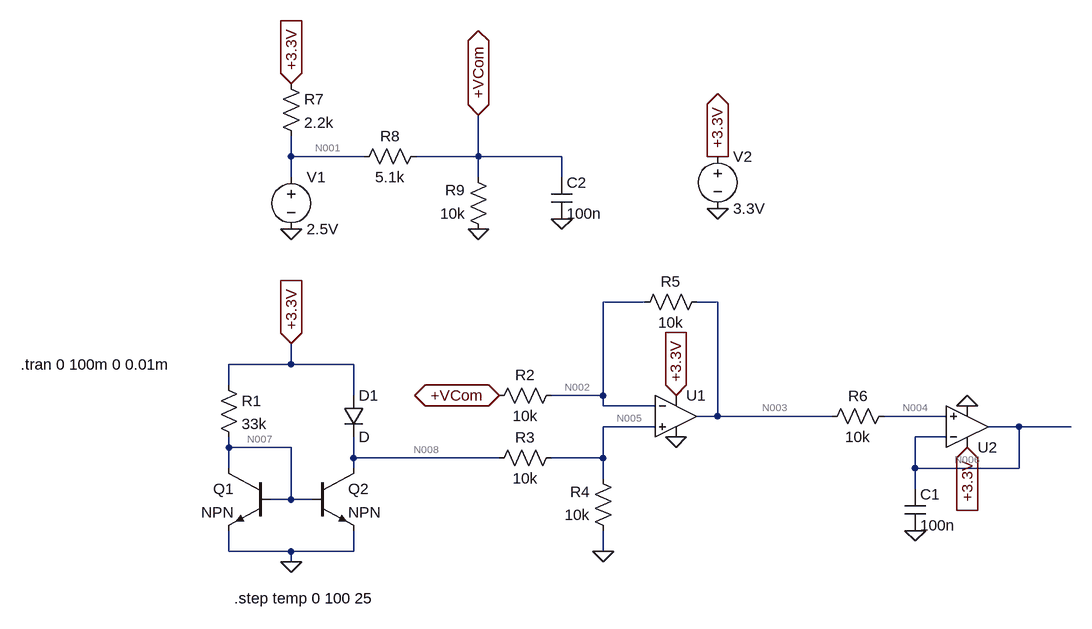
[diagram p0: schematic Temperature.asc]
Temperature.asc, the LTspice schematic file:
Version 4.1
SHEET 1 1568 1540
WIRE 96 -320 96 -352
WIRE 208 -320 96 -320
WIRE 384 -320 384 -384
WIRE 384 -320 288 -320
WIRE 512 -320 384 -320
WIRE 96 -288 96 -320
WIRE 384 -288 384 -320
WIRE 512 -288 512 -320
WIRE 640 -96 576 -96
WIRE 752 -96 720 -96
WIRE 96 0 96 -32
WIRE 96 0 0 0
WIRE 192 0 96 0
WIRE 0 32 0 0
WIRE 192 48 192 0
WIRE 576 48 576 -96
WIRE 576 48 496 48
WIRE 576 64 576 48
WIRE 656 64 576 64
WIRE 752 80 752 -96
WIRE 752 80 720 80
WIRE 928 80 752 80
WIRE 1104 80 1008 80
WIRE 656 96 576 96
WIRE 1216 96 1168 96
WIRE 1296 96 1216 96
WIRE 1104 112 1056 112
WIRE 0 128 0 112
WIRE 96 128 0 128
WIRE 192 144 192 112
WIRE 416 144 192 144
WIRE 576 144 576 96
WIRE 576 144 496 144
WIRE 0 160 0 128
WIRE 192 160 192 144
WIRE 1056 160 1056 112
WIRE 1216 160 1216 96
WIRE 1216 160 1056 160
WIRE 576 176 576 144
WIRE 1056 192 1056 160
WIRE 96 208 96 128
WIRE 96 208 64 208
WIRE 128 208 96 208
WIRE 0 288 0 256
WIRE 96 288 0 288
WIRE 192 288 192 256
WIRE 192 288 96 288
WIRE 576 288 576 256
WIRE 96 304 96 288
FLAG 96 304 0
FLAG 576 288 0
FLAG 752 -240 0
FLAG 752 -320 +3.3V
IOPIN 752 -320 Out
FLAG 96 -32 +3.3V
IOPIN 96 -32 In
FLAG 688 48 +3.3V
IOPIN 688 48 In
FLAG 1136 128 +3.3V
IOPIN 1136 128 In
FLAG 1136 64 0
FLAG 688 112 0
FLAG 1056 256 0
FLAG 96 -208 0
FLAG 384 -208 0
FLAG 512 -224 0
FLAG 384 -384 +VCom
IOPIN 384 -384 BiDir
FLAG 416 48 +VCom
IOPIN 416 48 BiDir
FLAG 96 -432 +3.3V
IOPIN 96 -432 In
SYMBOL npn 64 160 M0
SYMATTR InstName Q1
SYMBOL npn 128 160 R0
SYMATTR InstName Q2
SYMBOL res -16 16 R0
SYMATTR InstName R1
SYMATTR Value 33k
SYMBOL diode 176 48 R0
SYMATTR InstName D1
SYMBOL OpAmps\\UniversalOpAmp2 688 80 R0
SYMATTR InstName U1
SYMBOL res 512 32 R90
WINDOW 0 0 56 VBottom 2
WINDOW 3 32 56 VTop 2
SYMATTR InstName R2
SYMATTR Value 10k
SYMBOL res 512 128 R90
WINDOW 0 0 56 VBottom 2
WINDOW 3 32 56 VTop 2
SYMATTR InstName R3
SYMATTR Value 10k
SYMBOL res 592 272 R180
WINDOW 0 36 76 Left 2
WINDOW 3 36 40 Left 2
SYMATTR InstName R4
SYMATTR Value 10k
SYMBOL res 736 -112 R90
WINDOW 0 0 56 VBottom 2
WINDOW 3 32 56 VTop 2
SYMATTR InstName R5
SYMATTR Value 10k
SYMBOL OpAmps\\UniversalOpAmp2 1136 96 M180
SYMATTR InstName U2
SYMBOL res 1024 64 R90
WINDOW 0 0 56 VBottom 2
WINDOW 3 32 56 VTop 2
SYMATTR InstName R6
SYMATTR Value 10k
SYMBOL cap 1040 192 R0
SYMATTR InstName C1
SYMATTR Value 100n
SYMBOL voltage 752 -336 R0
WINDOW 123 0 0 Left 0
WINDOW 39 0 0 Left 0
SYMATTR InstName V2
SYMATTR Value 3.3V
SYMBOL voltage 96 -304 R0
WINDOW 123 0 0 Left 0
WINDOW 39 0 0 Left 0
SYMATTR InstName V1
SYMATTR Value 2.5V
SYMBOL res 80 -448 R0
SYMATTR InstName R7
SYMATTR Value 2.2k
SYMBOL res 304 -336 R90
WINDOW 0 0 56 VBottom 2
WINDOW 3 32 56 VTop 2
SYMATTR InstName R8
SYMATTR Value 5.1k
SYMBOL res 400 -192 R180
WINDOW 0 36 76 Left 2
WINDOW 3 36 40 Left 2
SYMATTR InstName R9
SYMATTR Value 10k
SYMBOL cap 496 -288 R0
SYMATTR InstName C2
SYMATTR Value 100n
TEXT -320 0 Left 2 !.tran 0 100m 0 0.01m
TEXT 8 360 Left 2 !.step temp 0 100 25

The netlist it stands for:
* Temperature.asc
Q1 N007 N007 0 0 NPN
Q2 N008 N007 0 0 NPN
R1 +3.3V N007 33k
D1 +3.3V N008 D
X§U1 N005 N002 +3.3V 0 N003 level2 Avol=1Meg GBW=10Meg Slew=10Meg Ilimit=25m Rail=0 Vos=0 En=0 Enk=0 In=0 Ink=0 Rin=500Meg  ; pins In+ In- V+ V- OUT
R2 N002 +VCom 10k
R3 N005 N008 10k
R4 0 N005 10k
R5 N003 N002 10k
X§U2 N004 N006 +3.3V 0 N006 level2 Avol=1Meg GBW=10Meg Slew=10Meg Ilimit=25m Rail=0 Vos=0 En=0 Enk=0 In=0 Ink=0 Rin=500Meg  ; pins In+ In- V+ V- OUT
R6 N004 N003 10k
C1 N006 0 100n
V2 +3.3V 0 3.3V
V1 N001 0 2.5V
R7 +3.3V N001 2.2k
R8 +VCom N001 5.1k
R9 0 +VCom 10k
C2 +VCom 0 100n
.model D D
.lib standard.dio
.model NPN NPN
.model PNP PNP
.lib standard.bjt
.tran 0 100m 0 0.01m
.step temp 0 100 25
.lib UniversalOpAmp2.lib
.backanno
.end

* Results of the author's LTspice run, read from the files saved beside the schematic
* Operating Point (first step), zero values left out:
*   V(+3.3v) = 3.3 V
*   V(+vcom) = 1.57 V
*   V(n001) = 2.5 V
*   V(n002) = 1.317 V
*   V(n003) = 1.064 V
*   V(n004) = 1.064 V
*   V(n005) = 1.317 V
*   V(n006) = 1.064 V
*   V(n007) = 750.4 mV
*   V(n008) = 2.634 V
*   I(D1) = 207.5 µA
*   I(R1) = 77.26 µA
*   I(R2) = -25.3 µA
*   I(R3) = -131.7 µA
*   I(R4) = -131.7 µA
*   I(R5) = -25.3 µA
*   I(R6) = 1.172 nA
*   I(R7) = 363.6 µA
*   I(R8) = -182.3 µA
*   I(R9) = -157 µA
*   I(V1) = 181.3 µA
*   I(V2) = -944.8 µA
*   Ib(Q1) = 757.5 nA
*   Ib(Q2) = 757.5 nA
*   Ic(Q1) = 75.75 µA
*   Ic(Q2) = 75.75 µA
*   Ie(Q1) = -76.5 µA
*   Ie(Q2) = -76.5 µA
*   Ix(u1:1) = -665.7 pA
*   Ix(u1:2) = -665.7 pA
*   Ix(u1:3) = 142.1 µA
*   Ix(u1:4) = -167.4 µA
*   Ix(u1:5) = 25.3 µA
*   Ix(u2:1) = -1.172 nA
*   Ix(u2:2) = -1.172 nA
*   Ix(u2:3) = 154.3 µA
*   Ix(u2:4) = -154.3 µA
*   Ix(u2:5) = 1.172 nA
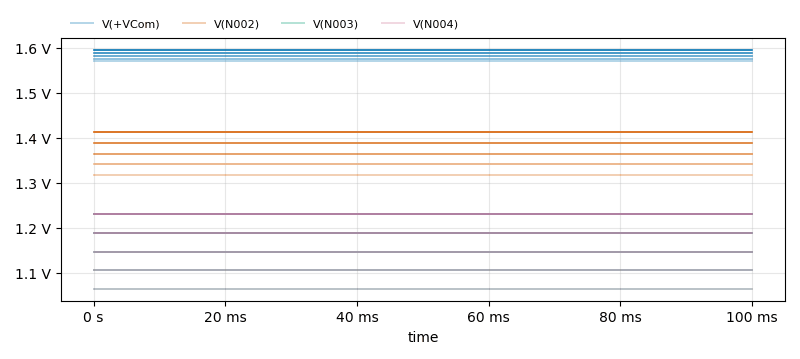
[diagram p1: Transient Analysis of Temperature.asc, plotted from the saved traces]
* Transient Analysis, 5 runs:
*   V(+VCom) [temp=0°]: min 1.57 V, max 1.57 V, average 1.57 V, rms 1.57 V, last 1.57 V
*   V(+VCom) [temp=25°]: min 1.576 V, max 1.576 V, average 1.576 V, rms 1.576 V, last 1.576 V
*   V(+VCom) [temp=50°]: min 1.582 V, max 1.582 V, average 1.582 V, rms 1.582 V, last 1.582 V
*   V(+VCom) [temp=75°]: min 1.588 V, max 1.588 V, average 1.588 V, rms 1.588 V, last 1.588 V
*   V(+VCom) [temp=100°]: min 1.594 V, max 1.594 V, average 1.594 V, rms 1.594 V, last 1.594 V
*   V(N002) [temp=0°]: min 1.317 V, max 1.317 V, average 1.317 V, rms 1.317 V, last 1.317 V
*   V(N002) [temp=25°]: min 1.341 V, max 1.341 V, average 1.341 V, rms 1.341 V, last 1.341 V
*   V(N002) [temp=50°]: min 1.364 V, max 1.364 V, average 1.364 V, rms 1.364 V, last 1.364 V
*   V(N002) [temp=75°]: min 1.388 V, max 1.388 V, average 1.388 V, rms 1.388 V, last 1.388 V
*   V(N002) [temp=100°]: min 1.412 V, max 1.412 V, average 1.412 V, rms 1.412 V, last 1.412 V
*   V(N003) [temp=0°]: min 1.064 V, max 1.064 V, average 1.064 V, rms 1.064 V, last 1.064 V
*   V(N003) [temp=25°]: min 1.105 V, max 1.105 V, average 1.105 V, rms 1.105 V, last 1.105 V
*   V(N003) [temp=50°]: min 1.147 V, max 1.147 V, average 1.147 V, rms 1.147 V, last 1.147 V
*   V(N003) [temp=75°]: min 1.189 V, max 1.189 V, average 1.189 V, rms 1.189 V, last 1.189 V
*   V(N003) [temp=100°]: min 1.231 V, max 1.231 V, average 1.231 V, rms 1.231 V, last 1.231 V
*   V(N004) [temp=0°]: min 1.064 V, max 1.064 V, average 1.064 V, rms 1.064 V, last 1.064 V
*   V(N004) [temp=25°]: min 1.105 V, max 1.105 V, average 1.105 V, rms 1.105 V, last 1.105 V
*   V(N004) [temp=50°]: min 1.147 V, max 1.147 V, average 1.147 V, rms 1.147 V, last 1.147 V
*   V(N004) [temp=75°]: min 1.189 V, max 1.189 V, average 1.189 V, rms 1.189 V, last 1.189 V
*   V(N004) [temp=100°]: min 1.231 V, max 1.231 V, average 1.231 V, rms 1.231 V, last 1.231 V